# Altium schematic sheet ShutdownDPDT-S01-V00.SchDoc
size A3; SheetNumber: 1; SheetTotal: 3
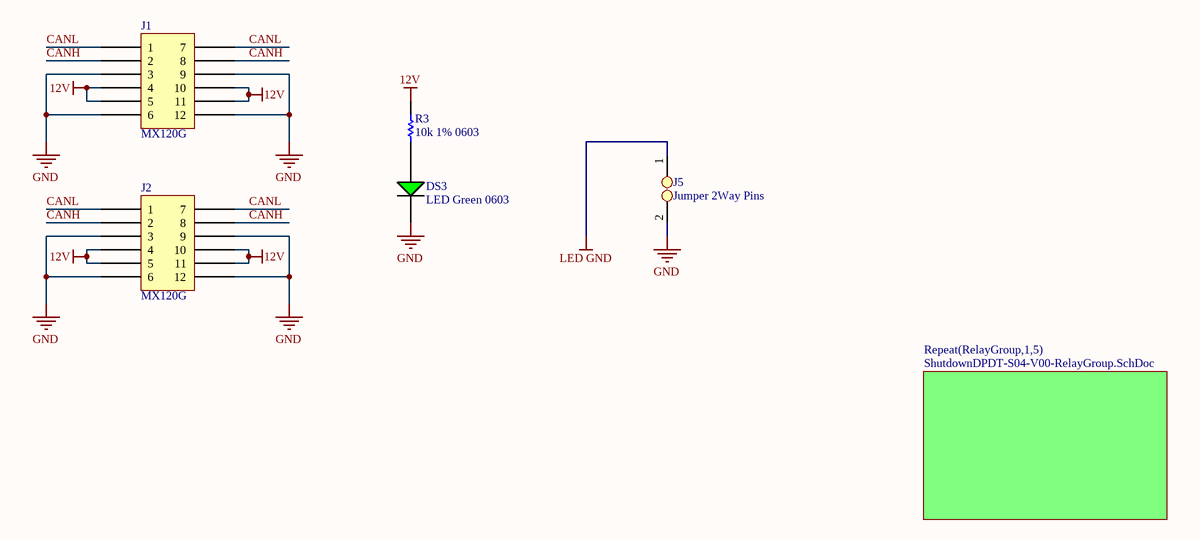
[diagram p0: ShutdownDPDT-S01-V00.SchDoc]

## Parts
DS3  LED Green 0603  [LED GREEN 0603]
J1  MX120G  [MX120G]
J2  MX120G  [MX120G]
J5  Jumper 2Way Pins  [Jumper_2Way_Pin]
R3  10k 1% 0603  [Res_ThinFilm_0603]

## Sub-sheets
Repeat(RelayGroup,1,5) = ShutdownDPDT-S04-V00-RelayGroup.SchDoc: no entries

## Nets
12V: J1.4 J1.5 J1.10 J1.11 J2.4 J2.5 J2.10 J2.11 R3.2
GND: DS3.2(C) J1.3 J1.6 J1.9 J1.12 J2.3 J2.6 J2.9 J2.12 J5.2
LED GND: J5.1
CANH: J1.2 J1.8 J2.2 J2.8
CANL: J1.1 J1.7 J2.1 J2.7
NetDS3_1: DS3.1(A) R3.1

## Library data of the parts
J1 J2 = MX120G: MX120G with standard connector layout
J5 = Jumper 2Way Vert Pins
R3 = 10k 1% 0603: Resistor, SMD, 10k, 0.1W, 1%, 0603